# EasyEDA Pro project PCB.epro

# Board PCB1
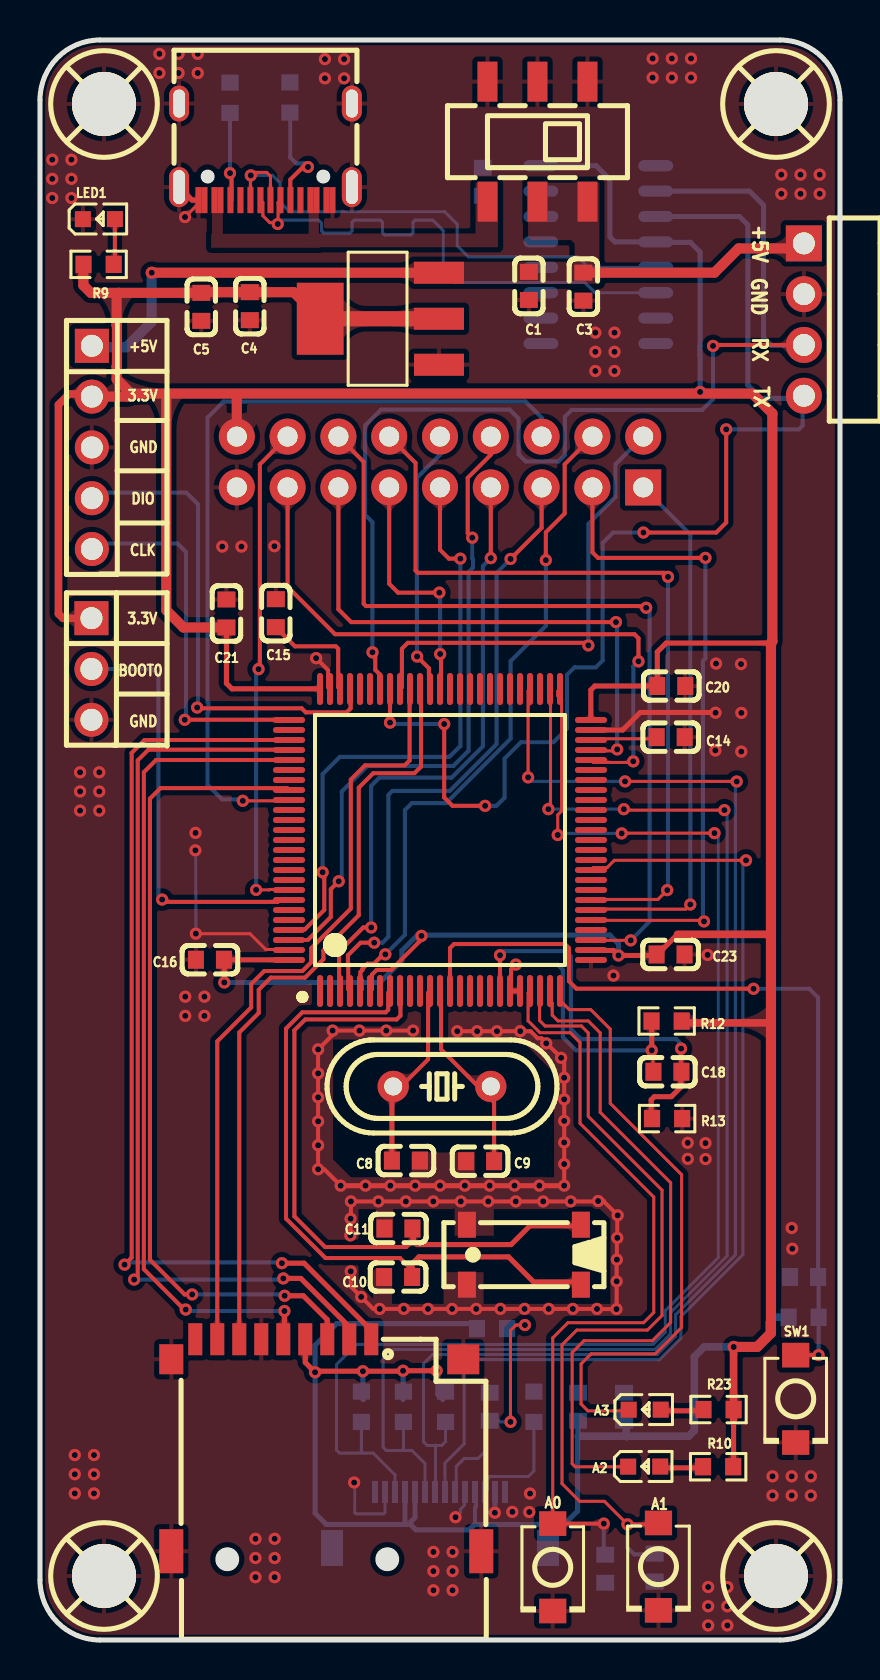
[diagram p0: board, top side]
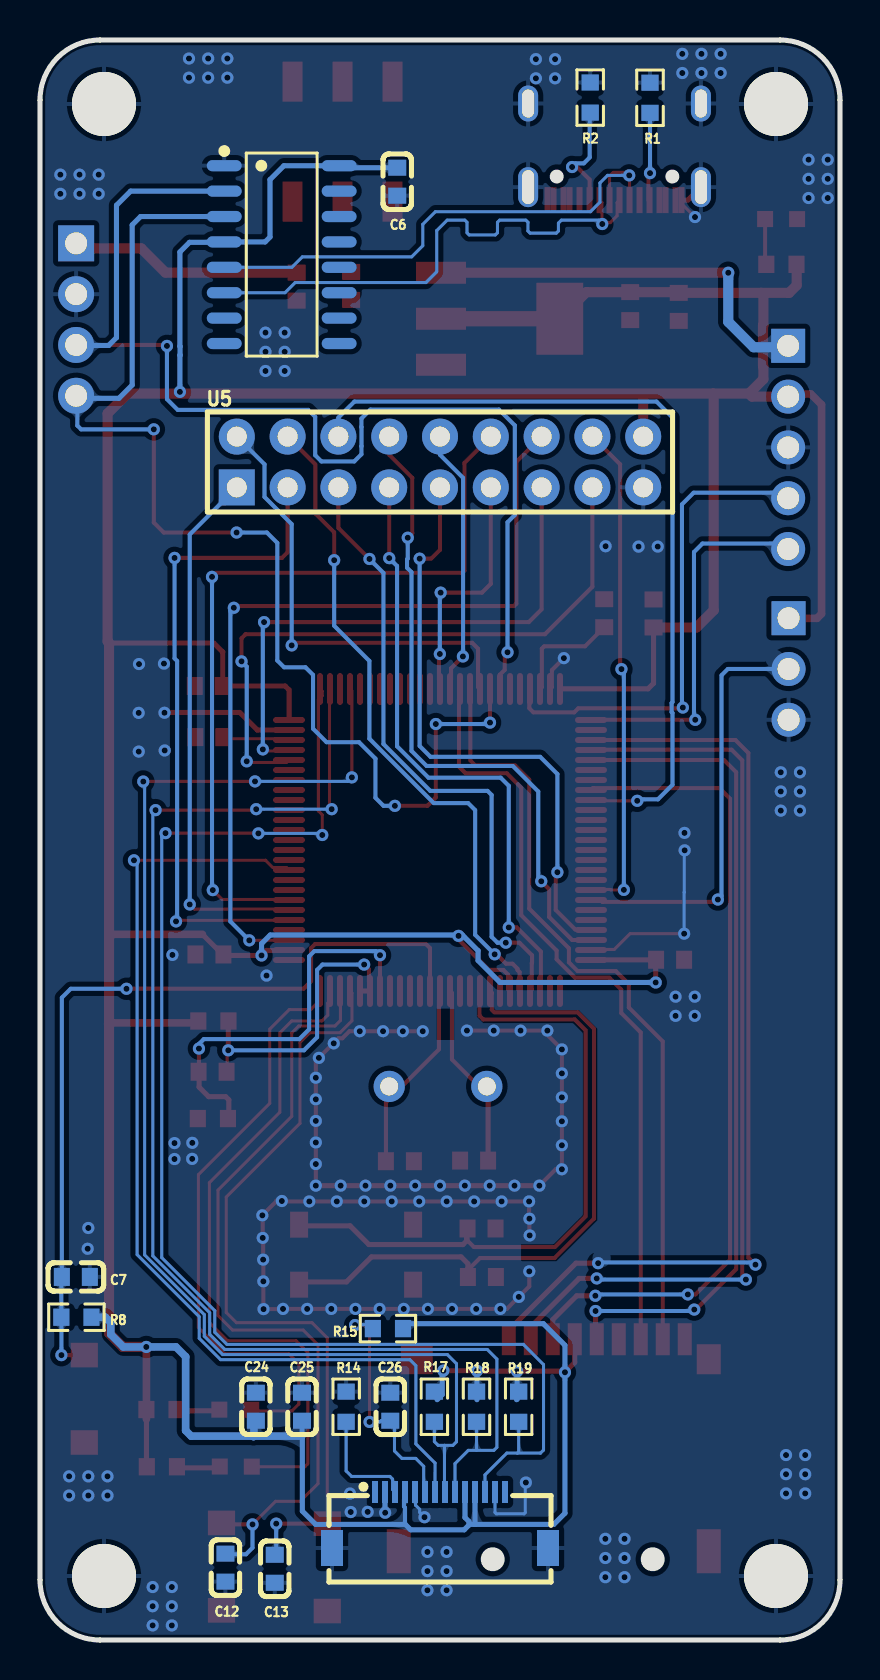
[diagram p1: board, bottom side, seen from below]

Outline 40 x 80 mm; copper layers: Top Layer, Bottom Layer. Coordinates in mm from the lower left corner of the outline.
Outline path: 0,77 0,3 arc(0.88,0.88) 3,0 37,0 arc(39.12,0.88) 40,3 40,77 arc(39.12,79.12) 37,80 3,80 arc(0.88,79.12) 0,77
Stack: Top Layer 0.035mm / Dielectric1 1.51mm FR4 er 4.5 / Bottom Layer 0.035mm

## Design rules (mm)
net OSCH1: DP2
net OSCH2: DP2
net OSCL1: DP1
net OSCL2: DP1
net DP: DP3
net DN: DP3
template: JLCPCB Capability(Two Layers Board)
spacing copperThickness1oz (default): track to track 0.102, other pairs 0.152 to 0.3
spacing copperThickness2oz: track to track 0.203, other pairs 0.152 to 0.3
track width copperThickness1oz (default): min 0.127, default 0.254, max 2.54
track width copperThickness2oz: min 0.203, default 0.254, max 2.54
differential pair differentialPair (default): width min 0.127, default 0.254, max 2.54; gap min 0.152, default 0.152
via viaSize (default): diameter min 0.5, default 0.61, max 10; hole min 0.3, default 0.305, max 6.3

## Placement (name value [footprint] x y rotation side)
A2  -  [LED_0603]  30.26 8.68 0 top
A3  -  [LED_0603]  30.29 11.52 0 top
C1  100nF  [C0603]  24.44 67.7 90 top
C3  10uF  [C0603]  27.17 67.67 90 top
C4  10uF  [C0603]  10.49 66.69 90 top
C5  100nF  [C0603]  8.06 66.66 90 top
C6  100nF  [C0603]  22.14 72.91 270 bottom
C7  100nF  [C0603]  38.21 18.15 0 bottom
C8  33pF  [C0603]  18.3 23.97 180 top
C9  33pF  [C0603]  22 23.94 180 top
C10  18pF  [C0603]  17.91 18.15 0 top
C11  18pF  [C0603]  17.92 20.57 0 top
C12  100nF  [C0603]  30.73 3.62 90 bottom
C13  100nF  [C0603]  28.26 3.56 90 bottom
C14  2.2uF  [C0603]  31.53 45.14 0 top
C15  2.2uF  [C0603]  11.79 51.34 270 top
C16  100nF  [C0603]  8.5 34.01 0 top
C18  10uF  [C0603]  31.37 28.41 0 top
C20  100nF  [C0603]  31.56 47.7 0 top
C21  100nF  [C0603]  9.32 51.33 90 top
C23  100nF  [C0603]  31.53 34.28 0 top
C24  10uF  [C0603]  29.21 11.66 270 bottom
C25  100nF  [C0603]  26.9 11.66 270 bottom
C26  100nF  [C0603]  22.49 11.66 90 bottom
CARD1  TF PUSH  [TF-SMD_TF-PUSH]  14.31 9.74 0 top
FPC1  FPC-05F-14PH15  [FPC-SMD_14P-P0.50_XUNPU_FPC-05F-14PH15]  20 6 180 bottom
H1  PZ254V-11-05P  [HDR-TH_5P-P2.54-V-M]  2.59 59.63 270 top
H2  PZ254V-11-03P  [HDR-TH_3P-P2.54-V-M]  2.57 48.55 270 top
H3  HX PZ2.54-1x4P WZ  [HDR-TH_4P-P2.54-H-M-W10.3]  38.19 66.02 270 top
LED1  -  [LED_0603]  3 71.05 0 top
R1  5.1K  [R0603]  9.5 77.11 90 bottom
R2  5.1K  [R0603]  12.49 77.12 90 bottom
R8  10K  [R0603]  38.18 16.14 0 bottom
R9  2K  [R0603]  2.93 68.78 0 top
R10  2K  [R0603]  33.91 8.66 180 top
R12  0  [R0603]  31.33 30.95 180 top
R13  0  [R0603]  31.35 26.07 180 top
R14  10  [R0603]  24.69 11.66 270 bottom
R15  10K  [R0603]  22.6 15.57 180 bottom
R17  10K  [R0603]  20.28 11.66 90 bottom
R18  10K  [R0603]  18.17 11.66 90 bottom
R19  10K  [R0603]  16.07 11.66 90 bottom
R23  2K  [R0603]  33.93 11.52 180 top
SCREW1  -  [M3螺丝]  36.8 76.8 0 top
SCREW2  -  [M3螺丝]  3.2 76.8 0 top
SCREW3  -  [M3螺丝]  36.8 3.2 0 top
SCREW4  -  [M3螺丝]  3.2 3.2 0 top
SW1  TS-1088R-02026  [SW-SMD_L3.9-W3.0-P4.45]  37.78 12.06 270 top
SW2  TS-1088R-02026  [SW-SMD_L3.9-W3.0-P4.45]  30.92 3.67 270 top
SW3  TS-1088R-02026  [SW-SMD_L3.9-W3.0-P4.45]  25.64 3.63 270 top
U1  STM32H743VIT6  [LQFP-100_L14.0-W14.0-P0.50-LS16.0-BL]  20 40 0 top
U3  AMS1117-3.3  [SOT-223-3_L6.5-W3.4-P2.30-LS7.0-BR]  16.98 66.06 0 top
U4  CH340C  [SOP-16_L10.0-W3.9-P1.27-LS6.0-BL]  27.91 69.27 270 bottom
U5  HC-PM254-8.5H-2x9PZ  [HDR-TH_18P-P2.54-V-F-R2-C9-S2.54-3]  20 58.9 180 bottom
U6  YSSP2AG00  [SW-SMD_YSSP2AG00]  24.87 74.92 180 top
USB1  HC-TYPE-C-16P-01B  [USB-C-SMD_KH-TYPE-C-16P]  11.27 74.41 180 top
X1  8MHz  [HC-49S_L11.5-W4.7-P4.88]  20.1 27.68 0 top
X2  32.768kHz  [MC-306_4P-L8.0-W3.2-P5.5-BL]  24.2 19.27 180 top

## Footprints (pads in the part's own frame, mm; a bottom-side part is the same pattern mirrored in y, then rotated)
C0603
  rect 0.8x0.9 smd: 1(-0.7,0) 2(0.7,0)
FPC-SMD_14P-P0.50_XUNPU_FPC-05F-14PH15
  rect 0.3x1.1 smd: 1(-3.25,1.4) 2(-2.75,1.4) 3(-2.25,1.4) 4(-1.75,1.4) 5(-1.25,1.4) 6(-0.75,1.4) 7(-0.25,1.4) 8(0.25,1.4) 9(0.75,1.4) 10(1.25,1.4) 11(1.75,1.4) 12(2.25,1.4) 13(2.75,1.4) 14(3.25,1.4)
  rect 1.1x1.8 smd: 15(5.4,-1.4) 16(-5.4,-1.4)
HC-49S_L11.5-W4.7-P4.88
  round 1.56 hole 0.9: 1(-2.44,0) 2(2.44,0)
HDR-TH_3P-P2.54-V-M
  rect 1.7x1.7 hole 1.1: 1(-2.54,0)
  round 1.7 hole 1.1: 2(0,0) 3(2.54,0)
HDR-TH_4P-P2.54-H-M-W10.3
  rect 1.8x1.8 hole 1.1: 1(-3.81,0)
  round 1.8 hole 1.1: 2(-1.27,0) 3(1.27,0) 4(3.81,0)
HDR-TH_5P-P2.54-V-M
  rect 1.7x1.7 hole 1.1: 1(-5.08,0)
  round 1.7 hole 1.1: 2(-2.54,0) 3(0,0) 4(2.54,0) 5(5.08,0)
HDR-TH_18P-P2.54-V-F-R2-C9-S2.54-3
  rect 1.8x1.8 hole 1: 1(-10.16,-1.27)
  round 1.8 hole 1: 2(-10.16,1.27) 3(-7.62,-1.27) 4(-7.62,1.27) 5(-5.08,-1.27) 6(-5.08,1.27) 7(-2.54,-1.27) 8(-2.54,1.27) 9(0,-1.27) 10(0,1.27) 11(2.54,-1.27) 12(2.54,1.27) 13(5.08,-1.27) 14(5.08,1.27) 15(7.62,-1.27) 16(7.62,1.27) 17(10.16,-1.27) 18(10.16,1.27)
LED_0603
  rect 0.8x0.8 smd: 1(-0.851,-0.01) 2(0.75,-0.005)
LQFP-100_L14.0-W14.0-P0.50-LS16.0-BL
  oval 0.3x1.6 smd: 1(-6,-7.55) 2(-5.5,-7.55) 3(-5,-7.55) 4(-4.5,-7.55) 5(-4,-7.55) 6(-3.5,-7.55) 7(-3,-7.55) 8(-2.5,-7.55) 9(-2,-7.55) 10(-1.5,-7.55) 11(-1,-7.55) 12(-0.5,-7.55) 13(0,-7.55) 14(0.5,-7.55) 15(1,-7.55) 16(1.5,-7.55) 17(2,-7.55) 18(2.5,-7.55) 19(3,-7.55) 20(3.5,-7.55) 21(4,-7.55) 22(4.5,-7.55) 23(5,-7.55) 24(5.5,-7.55) 25(6,-7.55) 51(6,7.55) 52(5.5,7.55) 53(5,7.55) 54(4.5,7.55) 55(4,7.55) 56(3.5,7.55) 57(3,7.55) 58(2.5,7.55) 59(2,7.55) 60(1.5,7.55) 61(1,7.55) 62(0.5,7.55) 63(0,7.55) 64(-0.5,7.55) 65(-1,7.55) 66(-1.5,7.55) 67(-2,7.55) 68(-2.5,7.55) 69(-3,7.55) 70(-3.5,7.55) 71(-4,7.55) 72(-4.5,7.55) 73(-5,7.55) 74(-5.5,7.55) 75(-6,7.55)
  oval 1.6x0.3 smd: 26(7.55,-6) 27(7.55,-5.5) 28(7.55,-5) 29(7.55,-4.5) 30(7.55,-4) 31(7.55,-3.5) 32(7.55,-3) 33(7.55,-2.5) 34(7.55,-2) 35(7.55,-1.5) 36(7.55,-1) 37(7.55,-0.5) 38(7.55,0) 39(7.55,0.5) 40(7.55,1) 41(7.55,1.5) 42(7.55,2) 43(7.55,2.5) 44(7.55,3) 45(7.55,3.5) 46(7.55,4) 47(7.55,4.5) 48(7.55,5) 49(7.55,5.5) 50(7.55,6) 76(-7.55,6) 77(-7.55,5.5) 78(-7.55,5) 79(-7.55,4.5) 80(-7.55,4) 81(-7.55,3.5) 82(-7.55,3) 83(-7.55,2.5) 84(-7.55,2) 85(-7.55,1.5) 86(-7.55,1) 87(-7.55,0.5) 88(-7.55,0) 89(-7.55,-0.5) 90(-7.55,-1) 91(-7.55,-1.5) 92(-7.55,-2) 93(-7.55,-2.5) 94(-7.55,-3) 95(-7.55,-3.5) 96(-7.55,-4) 97(-7.55,-4.5) 98(-7.55,-5) 99(-7.55,-5.5) 100(-7.55,-6)
M3螺丝
  round 3.2 hole 3.2: 1(0,0)
MC-306_4P-L8.0-W3.2-P5.5-BL
  rect 0.9x1.3 smd: 1(-2.85,-1.5) 2(2.85,-1.5) 3(2.85,1.5) 4(-2.85,1.5)
R0603
  rect 0.806x0.864 smd: 1(-0.753,0) 2(0.753,0)
SOP-16_L10.0-W3.9-P1.27-LS6.0-BL
  oval 0.56x1.745 smd: 1(-4.445,-2.873) 2(-3.175,-2.873) 3(-1.905,-2.873) 4(-0.635,-2.873) 5(0.635,-2.873) 6(1.905,-2.873) 7(3.175,-2.873) 8(4.445,-2.873) 9(4.445,2.873) 10(3.175,2.873) 11(1.905,2.873) 12(0.635,2.873) 13(-0.635,2.873) 14(-1.905,2.873) 15(-3.175,2.873) 16(-4.445,2.873)
SOT-223-3_L6.5-W3.4-P2.30-LS7.0-BR
  rect 2.5x1.1 smd: 1(2.97,-2.3) 2(2.97,0) 3(2.97,2.3)
  rect 2.34x3.6 smd: 4(-2.97,0)
SW-SMD_L3.9-W3.0-P4.45
  rect 1.23x1.36 smd: 1(-2.185,0) 2(2.185,0)
SW-SMD_YSSP2AG00
  rect 1x2 smd: 1(-2.5,3) 2(0,3) 3(2.5,3) 4(-2.5,-3) 5(0,-3) 6(2.5,-3)
TF-SMD_TF-PUSH
  rect 0.7x1.6 smd: 1(2.25,5.3) 2(1.15,5.3) 3(0.05,5.3) 4(-1.05,5.3) 5(-2.15,5.3) 6(-3.25,5.3) 7(-4.35,5.3) 8(-5.45,5.3) CD(-6.55,5.3)
  rect 1.2x1.5 smd: 10(-7.75,4.3)
  rect 1.2x2.2 smd: 11(-7.75,-5.3) 12(7.75,-5.3)
  rect 1.6x1.5 smd: 13(6.85,4.3)
USB-C-SMD_KH-TYPE-C-16P
  oval 1x2 hole 0.6x1.7: 1(-4.32,1.765) 2(4.32,1.765)
  oval 1x1.8 hole 0.6x1.4: 3(-4.32,-2.415) 4(4.32,-2.415)
  rect 0.3x1.3 smd: A1(-3.35,2.415) A4(-2.55,2.415) A5(-1.25,2.415) A6(-0.25,2.415) A7(0.25,2.415) A8(1.25,2.415) A9(2.55,2.415) A12(3.35,2.415) B1(3.05,2.415) B4(2.25,2.415) B5(1.75,2.415) B6(0.75,2.415) B7(-0.75,2.415) B8(-1.75,2.415) B9(-2.25,2.415) B12(-3.05,2.415)

## Nets
AGND: C18.2 R13.2 U1.19
GND: C1.1 C3.1 C4.1 C5.1 C6.2 C7.1 C8.1 C9.2 C10.1 C11.1 C12.1 C13.1 C14.2 C15.1 C16.1 C20.2 C21.2 C23.2 C24.1 C25.1 C26.2 CARD1.6 CARD1.10 CARD1.11 CARD1.12 CARD1.13 FPC1.2 FPC1.5 FPC1.13 FPC1.15 FPC1.16 H1.3 H2.3 H3.2 LED1.1 R1.2 R2.2 R13.1 R14.1 SCREW1.1 SCREW2.1 SCREW3.1 SCREW4.1 SW1.2 SW2.2 SW3.2 U1.26 U1.49 U1.74 U1.99 U3.1 U4.1 U5.17 U6.4 U6.5 U6.6 USB1.1 USB1.2 USB1.3 USB1.4 USB1.A1 USB1.A12 USB1.B1 USB1.B12 X2.2 X2.3
VCC+3.3V: C4.2 C5.2 C6.1 C16.2 C20.1 C21.1 C23.1 C24.2 C25.2 CARD1.4 FPC1.4 FPC1.10 FPC1.11 H1.2 H2.1 R8.1 R9.1 R10.1 R12.1 R15.2 R17.2 R18.2 R19.2 R23.1 U1.6 U1.27 U1.50 U1.75 U1.100 U3.2 U3.4 U4.4 U4.16 U5.18
VCC+5V: C1.2 C3.2 H1.1 H3.1 U3.3 U6.1 U6.2
VCCA+3.3V: C18.1 R12.2 U1.20 U1.21
BOOT0: H2.2 U1.94
CAM_RST: U1.32 U5.12
CC1: R2.1 USB1.A5
CC2: R1.1 USB1.B5
CS: FPC1.12 R19.1 U1.51
CSI_D0: U1.63 U5.11
CSI_D1: U1.64 U5.10
CSI_D2: U1.97 U5.9
CSI_D3: U1.98 U5.8
CSI_D4: U1.3 U5.7
CSI_D5: U1.84 U5.6
CSI_D6: U1.4 U5.5
CSI_D7: U1.5 U5.4
CSI_HSYNC: U1.28 U5.14
CSI_MCLK: U1.67 U5.2
CSI_PCLK: U1.30 U5.3
CSI_PWDN: U1.31 U5.1
CSI_VSYNC: U1.93 U5.16
DC: FPC1.7 U1.35
DN: U4.6 USB1.A7 USB1.B7
DP: U4.5 USB1.A6 USB1.B6
NRST: C26.1 FPC1.6 R15.1
OSCH1: C8.2 U1.12 X1.1
OSCH2: C9.1 U1.13 X1.2
OSCL1: C10.2 U1.8 X2.4
OSCL2: C11.2 U1.9 X2.1
PA0: C13.2 SW3.1 U1.22
PA1: C12.2 SW2.1 U1.23
PA2: A2.1 U1.24
PA3: A3.1 U1.25
PA5: U1.29
PA9: H3.4 U1.68 U4.3
PA10: H3.3 U1.69 U4.2
PA11: U1.70
PA12: U1.71
PA13: H1.4 U1.72
PA14: H1.5 U1.76
PA15: U1.77
PB0: U1.34
PB2: U1.36
PB3: U1.89
PB4: U1.90
PB5: U1.91
PB6: U1.92
PB8: U1.95
PB9: U1.96
PB10: U1.46 U5.15
PB11: U1.47 U5.13
PB13: FPC1.9 R18.1 U1.52
PB14: U1.53
PB15: FPC1.8 R17.1 U1.54
PC0: U1.15
PC1: U1.16
PC2: U1.17
PC3: U1.18
PC5: U1.33
PC8: CARD1.7 U1.65
PC9: CARD1.8 U1.66
PC10: CARD1.1 U1.78
PC11: CARD1.2 U1.79
PC12: CARD1.5 U1.80
PC13: U1.7
PD0: U1.81
PD1: U1.82
PD2: CARD1.3 U1.83
PD4: U1.85
PD5: U1.86
PD6: U1.87
PD7: U1.88
PD8: U1.55
PD9: U1.56
PD10: U1.57
PD11: U1.58
PD12: U1.59
PD13: U1.60
PD14: U1.61
PD15: U1.62
PE2: U1.1
PE3: U1.2
PE7: U1.37
PE8: U1.38
PE9: U1.39
PE10: U1.40
PE11: U1.41
PE12: U1.42
PE13: U1.43
PE14: U1.44
PE15: U1.45
RST: C7.2 R8.2 SW1.1 U1.14
USB+5V: U6.3 USB1.A4 USB1.A9 USB1.B4 USB1.B9
$1N4402: LED1.2 R9.2
$1N4428: A2.2 R10.2
$1N4531: C14.1 U1.48
$1N4556: C15.2 U1.73
$1N9245: FPC1.3 R14.2
$1N24827: A3.2 R23.2

Pads without a net: CARD1 CD; FPC1 1 14; U1 10 11; U4 7 8 9 10 11 12 13 14 15; USB1 A8 B8

## Via types
v1: diameter 0.61, hole 0.305, Top Layer to Bottom Layer, 242 vias

## Routing (per net, layer and track width the routed paths; a pad name or vN(x,y) marks a point on that pad's centre or on a via; arc(x,y) is an arc through that point)
AGND: length 19.7
  Top Layer w0.203: U1.19 v1(23,34.24) ; v1(32.05,29.57) 32.05,28.41 32.04,28.4
  Top Layer w0.254: 30.59,26.18 30.56,26.21 30.56,27.01 30.72,27.17 31.57,27.17 32.04,27.64 32.04,28.4
  Bottom Layer w0.203: v1(32.05,29.57) 32.05,29.8 31.81,30.04 27.04,30.04 26.54,30.54 26.54,34.18 26.28,34.44 23.2,34.44 v1(23,34.24)
GND: length 97.2
  Top Layer w0.152: U1.99 11.99,34.5 11.96,34.53 11.29,34.53 10.5,35.32 v1(7.79,35.32) ; v1(7.25,71.15) 7.92,71.82 USB1.A12
  Top Layer w0.203: v1(26.21,22.72) v1(26.21,23.8) v1(26.21,24.88) v1(26.21,25.95) v1(26.21,27.03) v1(26.21,28.11) 26.21,28.95 v1(26.06,29.11) 25.08,30.09 24.88,30.09 24.53,30.44 v1(24.01,30.44) v1(22.85,30.44) v1(21.86,30.44) v1(20.86,30.44) ; v1(15.52,20.23) 15.53,20.24 v1(15.53,21.07) 15.55,21.08 v1(15.55,21.93) v1(16.92,21.93) v1(18.29,21.93) v1(19.67,21.93) v1(21.04,21.93) v1(22.41,21.93) v1(23.79,21.93) v1(25.16,21.93) v1(26.53,21.93) 27.89,21.93 ; v1(15.54,18.43) 15.54,17.68 v1(16.06,17.15) 16.66,16.55 v1(16.98,16.55) v1(18.19,16.55) v1(19.4,16.55) v1(20.61,16.55) v1(21.81,16.55) v1(23.02,16.55) v1(24.23,16.55) v1(25.43,16.55) v1(26.64,16.55) v1(27.85,16.55) 27.86,16.54 v1(28.82,16.54) 28.83,16.55 v1(28.83,17.93) 28.83,19.01 v1(28.84,19.02) 28.84,20.09 v1(28.86,20.11) 28.86,21.21 v1(28.88,21.23) 28.17,21.95 ; v1(15.03,22.72) 14.21,23.54 v1(13.91,23.54) v1(13.91,24.74) v1(13.91,25.93) v1(13.91,27.13) v1(13.91,28.33) v1(13.91,29.53) 14.63,30.26 v1(14.63,30.47) v1(15.97,30.47) v1(17.31,30.47) v1(18.65,30.47) ; U1.74 14.41,47.64 14.41,48.49 v1(13.81,49.09)
  Top Layer w0.254: 27.89,21.93 v1(27.91,21.95) 28.17,21.95 ; USB1.2 7.6,71.99 USB1.A12 ; v1(15.03,22.72) v1(16.27,22.72) v1(17.52,22.72) v1(18.76,22.72) v1(20,22.72) v1(21.24,22.72) v1(22.48,22.72) v1(23.73,22.72) v1(24.97,22.72) v1(26.21,22.72) ; U1.49 29.14,45.5 30.01,46.38 33.76,46.38 v1(33.78,46.36)
  Bottom Layer w0.152: FPC1.5 21.25,7.03 21.22,7.01 21.22,6.74 21.02,6.53 21.02,6.38 v1(20.78,6.14) ; FPC1.13 17.25,6.37 17.19,6.31 15.8,6.31 15.74,6.37 15.74,7.84 v1(15.71,7.87) ; v1(7.79,35.32) 7.79,37.38 7.79,37.39 7.79,39.47 v1(7.77,39.48)
  Bottom Layer w0.254: FPC1.2 22.75,6.37 v1(22.74,6.36)
  vias: v1(0.61,74.02) v1(0.61,73.06) v1(0.61,72.1) v1(1.57,74.02) v1(1.57,73.06) v1(1.57,72.1) v1(1.74,9.25) v1(1.74,8.29) v1(1.74,7.33) v1(2,43.39) v1(2,42.43) v1(2,41.47) v1(2.7,9.25) v1(2.7,8.29) v1(2.7,7.33) v1(2.96,43.39) v1(2.96,42.43) v1(2.96,41.47) v1(5.97,79.31) v1(5.97,78.35) v1(6.93,79.31) v1(6.93,78.35) v1(7.26,32.17) v1(7.26,31.21) v1(7.78,40.36) v1(7.89,79.31) v1(7.89,78.35) v1(8.22,32.17) v1(8.22,31.21) v1(9.11,54.67) v1(10.07,54.67) v1(10.77,5.06) v1(10.77,4.1) v1(10.77,3.14) v1(11.72,54.69) v1(11.73,5.06) v1(11.73,4.1) v1(11.73,3.14) v1(14.25,79.04) v1(14.25,78.08) v1(15.21,79.04) v1(15.21,78.08) v1(19.67,4.4) v1(19.67,3.44) v1(19.67,2.49) v1(20.63,4.4) v1(20.63,3.44) v1(20.63,2.49) v1(23.62,6.41) v1(24.5,7.32) v1(24.46,6.4) v1(25.31,29.83) v1(27.77,65.37) v1(27.77,64.41) v1(27.77,63.45) v1(28.73,65.37) v1(28.73,64.41) v1(28.73,63.45) v1(28.67,33.22) v1(30.63,79.07) v1(30.63,78.12) v1(31.59,79.07) v1(31.59,78.12) v1(32.39,24.86) v1(32.39,24.06) v1(32.55,79.07) v1(32.55,78.12) v1(33.28,24.85) v1(33.28,24.05) v1(33.38,34.25) v1(33.41,2.65) v1(33.41,1.69) v1(33.41,0.73) v1(33.8,48.82) v1(33.77,44.48) v1(34.37,2.65) v1(34.37,1.69) v1(34.37,0.73) v1(35.05,48.8) v1(35.07,46.36) v1(35.06,44.42) v1(36.63,8.18) v1(36.63,7.22) v1(37.07,73.27) v1(37.07,72.31) v1(37.59,20.6) v1(37.62,19.56) v1(37.59,8.18) v1(37.59,7.22) v1(38.02,73.27) v1(38.02,72.31) v1(38.54,8.18) v1(38.54,7.22) v1(38.98,73.27) v1(38.98,72.31)
VCC+3.3V: length 298.7
  Top Layer w0.203: U1.6 16.6,32.55 16.6,33.27 16.83,33.5 17.55,33.5 19.07,35.02 v1(19.07,35.21)
  Top Layer w0.254: U1.75 13.99,47.56 9.6,47.56 9.32,47.83 C21.1 ; 13.26,15.04 13.26,13.88 v1(13.75,13.39) 13.81,13.44 v1(16.15,13.44) 18.13,13.44 v1(18.15,13.46) 19.83,13.46 v1(19.83,13.47) ; U1.50 27.54,46.01 27.54,47.5 27.74,47.7 C20.1 30.86,49.4 31.31,49.85 36.43,49.85 ; U1.27 28.12,34.5 28.14,34.48 28.67,34.48 v1(28.92,34.23) 30.82,34.23 31.88,35.28 ; 34.68,11.04 34.68,8.68 R10.1 ; v1(9.22,32.88) 9.22,34.01 12.44,34.01 U1.100
  Top Layer w0.381: 34.68,11.04 R23.1 34.68,14.5 ; 2.63,51.09 2.63,51.08 1.15,51.08 0.92,51.31 0.92,61.77 1.46,62.3 2.33,62.3 2.48,62.44 ; R12.1 32.18,30.86 36.49,30.86 36.55,30.8 ; 31.88,35.28 36.47,35.28 ; 36.55,35.16 36.48,35.09 36.55,35.09 36.55,35.16
  Top Layer w0.508: 4.55,62.32 4.4,62.17 2.59,62.17 ; 4.55,62.32 3.83,63.04 3.83,63.67 3.85,63.69 3.85,65.73 3.83,65.74 3.83,67.24 3.95,67.36 ; 4.55,62.32 6.34,62.32 ; 36.55,49.85 36.55,35.16 ; 6.34,62.32 6.31,62.3 6.31,51.49 7.18,50.63 C21.1 ; 6.34,62.32 35.62,62.32 36.62,61.33 36.62,49.93 36.56,49.87 ; v1(34.69,14.65) 35.86,14.65 36.55,15.34 36.55,35.09 ; R9.1 2.17,68.77 2.17,67.73 2.55,67.36 3.95,67.36 ; U5.18 9.84,62.13 ; 3.95,67.36 C5.2 8.1,67.39 C4.2 12.68,67.39 U3.4
  Top Layer w0.762: U3.2 U3.4
  Bottom Layer w0.203: 21.75,5.79 21.75,6.62 21.8,6.67 21.8,7.02 21.75,7.07 FPC1.4
  Bottom Layer w0.254: C6.1 24.94,73.61 U4.16 27.8,73.71 28.5,73.02 28.5,70.15 28.74,69.9 U4.4 30.81,69.88 32.52,69.88 33,69.4 33,64.69 33,64.68 33,64.24 33,64.23 v1(33,62.41) ; 20.14,12.02 19.89,12.27 19.89,13.41 v1(19.83,13.47) ; 18.25,5.78 18.52,5.78 18.55,5.75 ; 18.25,5.78 FPC1.11 ; 18.25,5.78 14.31,5.78 13.75,6.34 v1(13.75,13.39) 13.75,14.74 14.83,15.82 21.84,15.82 21.84,15.78 21.85,15.77 ; 26.9,10.18 26.88,10.16 26.88,6.44 26.22,5.78 21.74,5.78 21.47,5.51 18.79,5.51 18.55,5.75 ; 26.9,10.18 26.91,10.19 ; 26.9,10.18 C25.2 ; v1(16.15,13.44) 16.15,12.04 16.17,12.02 ; 18.55,5.75 18.55,5.92 18.75,6.12 FPC1.10 ; v1(28.92,34.23) 28.92,34.81 28.49,35.25 18.88,35.25 18.09,34.47 18.09,33.97 17,32.88 v1(9.22,32.88) ; v1(18.15,13.46) 18.15,12.02
  Bottom Layer w0.381: 26.91,10.19 29.3,10.19 ; 29.3,10.19 29.3,10.86 C24.2 ; 29.3,10.19 29.33,10.17 29.35,10.19 32.44,10.19 32.72,10.47 32.72,14.17 33.2,14.65 v1(34.69,14.65) 35.83,14.65 36.46,15.28 36.46,15.87 36.73,16.14 R8.1
VCC+5V: length 32
  Top Layer w0.508: C3.2 33.73,68.37 34.94,69.58 37.94,69.58 H3.1 ; U3.3 v1(5.59,68.36)
  Bottom Layer w0.508: v1(5.59,68.36) 5.59,65.91 4.32,64.64 2.66,64.64 H1.1
VCCA+3.3V: length 14.7
  Top Layer w0.152: v1(30.59,29.48) 30.65,29.43 30.65,28.4
  Top Layer w0.203: U1.20 23.5,32.88 23.55,32.93 23.55,33.53 v1(23.79,33.77)
  Top Layer w0.254: 30.59,30.63 30.59,30.62 v1(30.59,29.48) ; U1.21 U1.20
  Bottom Layer w0.203: v1(23.79,33.77) 25.88,33.77 26.15,33.5 26.15,30.14 26.8,29.48 v1(30.59,29.48)
BOOT0: length 21.2
  Top Layer w0.203: U1.94 12.43,37.02 12,37.02 11.88,36.91 6.22,36.91 v1(6.11,37.02)
  Bottom Layer w0.203: 2.63,48.55 5.61,48.55 5.92,48.23 5.92,37.21 v1(6.11,37.02)
CAM_RST: length 39.7
  Top Layer w0.152: v1(31.36,37.49) 30.89,37.03 27.58,37.03 U1.32
  Top Layer w0.203: U5.12 18.78,58.85 18.78,53.47 18.89,53.36 31.2,53.36 v1(31.4,53.16)
  Bottom Layer w0.203: v1(31.36,37.49) 31.4,37.53 v1(31.4,53.16)
CC1: length 5.7
  Top Layer w0.203: USB1.A5 12.52,72 12.52,73.02 13.15,73.65 v1(13.4,73.65)
  Bottom Layer w0.203: 12.51,76.59 12.51,74.13 12.81,73.83 13.21,73.83 v1(13.4,73.65)
CC2: length 4.4
  Top Layer w0.203: 9.58,71.99 9.58,73.26 v1(9.5,73.34)
  Bottom Layer w0.203: R1.1 v1(9.5,73.34)
CS: length 68.8
  Top Layer w0.152: v1(25.89,40.25) 25.89,41.26 26.08,41.45 26.08,47.03 25.89,47.22 25.89,47.44 U1.51 ; v1(33.72,40.34) 29.09,40.34 v1(29.08,40.33)
  Bottom Layer w0.152: 16.13,9.34 16.07,9.41 R19.1 ; 16.13,9.34 14.98,9.34 14.82,9.5 14.82,13.77 15.83,14.78 30.65,14.78 31.26,15.39 31.26,16.47 33.91,19.12 33.91,40.16 v1(33.72,40.34) ; 16.13,9.34 16.66,9.34 17.75,8.26 FPC1.12 ; v1(25.89,40.25) 25.97,40.33 v1(29.08,40.33)
CSI_D0: length 12.4
  Top Layer w0.203: v1(19.97,52.37) 17.9,52.37 17.46,52.81 U5.11 ; v1(20.01,49.3) 20.05,49.26 20.05,48.03 20.01,47.99 20.01,47.56 U1.63
  Bottom Layer w0.203: v1(20.01,49.3) 20.01,52.33 v1(19.97,52.37)
CSI_D1: length 13.4
  Top Layer w0.203: v1(18.85,49.18) 19.45,48.58 19.45,48.03 19.5,47.98 U1.64
  Bottom Layer w0.203: v1(18.85,49.18) 18.85,49.19 18.85,58.11 20,59.26 U5.10
CSI_D2: length 30.2
  Top Layer w0.203: v1(14.13,38.39) 14.21,38.31 14.21,36.5 13.24,35.53 12.94,35.53 12.92,35.5 U1.97 ; v1(21.02,54.07) 20.44,54.07 20,54.51 U5.9
  Bottom Layer w0.203: v1(14.13,38.39) 14.13,38.39 14.13,43.3 14.99,44.16 20.47,44.16 21.02,44.7 v1(21.02,54.07)
CSI_D3: length 32.6
  Top Layer w0.203: U5.8 22.54,59.26 21.39,58.11 21.39,55.34 v1(21.61,55.11) ; U1.98 13.39,35 14.54,36.15 14.54,37.54 v1(14.94,37.94)
  Bottom Layer w0.203: v1(14.94,37.94) 15.09,38.09 15.09,42.42 16.36,43.7 20.67,43.7 21.43,44.46 21.43,53.39 21.65,53.61 21.65,54.03 21.61,54.07 v1(21.61,55.11)
CSI_D4: length 30.7
  Top Layer w0.203: U1.3 14.96,32.49 14.96,34.42 16.16,35.63 v1(16.56,35.63) ; U5.7 v1(22.54,54.09)
  Bottom Layer w0.203: v1(22.54,54.09) 22.15,53.7 22.15,44.69 20.58,43.12 16.97,43.12 16.56,42.71 v1(16.56,35.63)
CSI_D5: length 41.1
  Top Layer w0.152: v1(10.14,41.96) 12.41,41.96 U1.84
  Bottom Layer w0.203: U5.6 25.08,61.12 24.28,61.92 9.18,61.92 8.38,61.12 8.38,46.9 8.42,46.85 8.42,46.39 8.38,46.35 8.38,42.76 9.1,42.03 10.07,42.03 v1(10.14,41.96)
CSI_D6: length 31.6
  Top Layer w0.203: U1.4 15.41,32.54 15.41,33.85 15.4,33.86 15.4,34.23 16.03,34.86 v1(16.71,34.86) ; U5.5 25.08,55.6 v1(23.53,54.05)
  Bottom Layer w0.203: v1(23.53,54.05) 22.83,53.35 22.83,44.8 20.49,42.46 17.62,42.46 17.42,42.25 17.42,35.16 17.12,34.86 v1(16.71,34.86)
CSI_D7: length 33.8
  Top Layer w0.203: U5.4 26.23,58.78 26.23,56.33 25.29,55.39 v1(25.29,53.99) ; v1(17.27,34.28) 17.17,34.28 16.7,33.81 16.37,33.81 16.12,33.56 16.12,33.5 16.02,33.39 16.02,33.06 16.08,33 16.08,32.53 U1.5
  Bottom Layer w0.203: v1(17.27,34.28) 18.24,35.26 18.24,41.49 18.59,41.85 20.31,41.85 23.53,45.07 23.53,48.95 25.29,50.71 v1(25.29,53.99)
CSI_HSYNC: length 42.2
  Top Layer w0.152: v1(29.54,34.98) 27.57,34.98
  Top Layer w0.203: U5.14 16.18,58.91 16.18,51.81 16.3,51.7 30.22,51.7 v1(30.31,51.61) ; 27.56,34.99 U1.28
  Bottom Layer w0.203: v1(29.54,34.98) 30.48,35.93 30.48,51.44 v1(30.31,51.61)
CSI_MCLK: length 23.1
  Top Layer w0.203: v1(27.42,49.73) 27.29,49.86 18.39,49.86 18.1,49.57 18.1,47.65 U1.67
  Bottom Layer w0.203: v1(27.42,49.73) 27.42,55.79 28.77,57.15 28.77,58.78 U5.2
CSI_PCLK: length 33
  Top Layer w0.152: v1(33.2,35.93) 33.15,35.98 28.09,35.98 28.02,36.05 27.6,36.05 U1.30
  Top Layer w0.203: v1(33.27,54.11) 27.9,54.11 27.62,54.39 U5.3
  Bottom Layer w0.203: v1(33.27,54.11) 33.27,49.08 33.14,48.95 33.14,35.99 v1(33.2,35.93)
CSI_PWDN: length 26.9
  Top Layer w0.152: U1.31 27.6,36.55 30.44,36.55 30.44,36.54 32.28,36.54 v1(32.51,36.78)
  Bottom Layer w0.203: U5.1 32.51,55.28 v1(32.51,36.78)
CSI_VSYNC: length 25
  Top Layer w0.152: v1(10.81,37.51) 11.46,37.51 11.48,37.53 11.96,37.53 11.98,37.51 12.44,37.51 U1.93
  Top Layer w0.203: v1(10.93,48.54) 10.99,48.61 10.99,58.78 U5.16
  Bottom Layer w0.203: v1(10.81,37.51) 10.81,48.42 v1(10.93,48.54)
DC: length 51.3
  Top Layer w0.152: v1(35.3,38.98) 28.72,38.98 28.36,38.62 27.67,38.62 U1.35
  Bottom Layer w0.152: FPC1.7 20.25,8.85 21.21,9.81 21.21,13.72 21.51,14.02 30.97,14.02 32.04,15.09 32.04,16.16 35.14,19.27 35.14,38.83 v1(35.3,38.98)
DN: length 26.9
  Top Layer w0.152: v1(11.89,70.8) 11.9,70.81 11.9,70.89 ; USB1.B7 11.9,71.87 11.9,70.89 ; USB1.A7 11.15,71.87 11.15,71.21 11.49,70.87 11.88,70.87 11.9,70.89
  Bottom Layer w0.152: v1(11.89,70.8) 12.08,70.99 13.93,70.99 14.08,70.84 14.08,70.45 14.19,70.34 15.49,70.34 15.6,70.45 15.6,70.89 15.71,70.99 17.02,70.99 17.13,70.89 17.13,70.36 17.23,70.25 18.54,70.25 18.65,70.36 18.65,70.89 18.76,70.99 19.64,70.99 20.16,70.47 20.16,68.41 20.7,67.87 27.24,67.87 27.75,67.36 U4.6
DP: length 26.9
  Top Layer w0.152: USB1.B6 10.52,73.2 10.71,73.38 11.34,73.38 11.52,73.19 USB1.A6
  Bottom Layer w0.152: U4.5 27.41,68.63 26.88,69.16 21.42,69.16 20.86,69.71 20.86,70.78 20.23,71.42 12.48,71.42 12,71.89 12,72.85 11.62,73.23 v1(10.54,73.23)
NRST: length 12.1
  Top Layer w0.152: v1(24.25,15.75) 23.79,15.75 23.52,15.48 v1(23.52,10.9)
  Bottom Layer w0.152: 23.36,15.77 24.22,15.77 v1(24.25,15.75) ; v1(23.52,10.9) 23,10.9 22.94,10.96 C26.1 22.28,10.75 22.28,9.45 21.9,9.08 21.21,9.08 20.82,8.68 20.82,7.47 FPC1.6
OSCH1: length 9.6
  Top Layer w0.203: U1.12 19.4,32.35 19.4,29.03 18.25,27.88 17.74,27.88
  Top Layer w0.254: 17.74,27.88 17.6,27.74 C8.2
OSCH2: length 9.6
  Top Layer w0.203: C9.1 22.7,26.88 20.05,29.53 20.05,31.97 20,32.02 U1.13
OSCL1: length 33.1
  Top Layer w0.203: U1.8 17.41,32.36 17.41,31.51 17.28,31.38 13.12,31.38 12.3,30.57 12.3,21.07 14.27,19.1 18,19.1 18.5,18.59 18.6,18.59 ; 18.6,18.25 C10.2
  Top Layer w0.254: 18.6,18.25 18.6,18.81 18.94,19.16 23.43,19.16 24.68,17.9 26.98,17.9 27.05,17.97
OSCL2: length 33.1
  Top Layer w0.203: U1.9 18.02,32.43 18.02,31.22 17.83,31.03 13.26,31.03 12.72,30.48 12.72,21.18 14.25,19.65 18.31,19.65 18.62,19.97 C11.2
  Top Layer w0.254: 18.67,20.62 18.62,20.68 ; 18.67,20.57 18.67,19.95 18.85,19.77 23.56,19.77 24.49,20.71 26.79,20.71 27.05,20.97
PA0: length 38.5
  Top Layer w0.152: SW3.1 25.64,15.1 26.4,15.87 30.18,15.87 30.69,16.38 30.69,22.15 27,25.83 27,29.87 26.51,30.37 25,30.37 24.4,30.96 24.4,32.35 U1.22
  Top Layer w0.203: SW3.1 v1(28.19,5.82)
  Bottom Layer w0.203: 28.25,4.34 28.19,4.4 v1(28.19,5.82)
PA1: length 40.7
  Top Layer w0.152: U1.23 24.98,32.43 24.98,30.98 25.25,30.7 27.07,30.7 27.41,30.36 27.41,26.18 31.1,22.49 31.1,16.22 30.37,15.5 26.84,15.5 26.1,14.76 26.1,7.82 26.99,6.93 28.22,6.93 v1(29.37,5.78)
  Top Layer w0.203: 30.92,5.78 v1(29.37,5.78)
  Bottom Layer w0.203: C12.2 30.69,4.28 29.7,4.28 29.37,4.61 v1(29.37,5.78)
PA2: length 34.1
  Top Layer w0.152: 29.46,8.44 29.24,8.66 26.76,8.66 26.61,8.81 26.61,14.37 27.2,14.97 30.62,14.97 31.53,15.87 31.53,22.86 28.01,26.39 28.01,30.36 27.41,30.95 25.9,30.95 25.61,31.24 25.61,31.85 25.5,31.96 U1.24
PA3: length 30.3
  Top Layer w0.152: U1.25 26,31.98 26.46,31.52 27.54,31.52 28.51,30.54 28.51,26.83 32.08,23.26 32.08,15.62 30.77,14.31 27.56,14.31 27.05,13.81 27.05,11.8 27.4,11.46 29.43,11.46
PA9: length 60.3
  Top Layer w0.203: U1.68 v1(17.5,45.87) ; v1(20.21,45.8) 20.21,42.13 20.63,41.71 v1(22.26,41.71) ; v1(34.31,60.53) 34.31,55.87 33.81,55.37 v1(30.17,55.37)
  Bottom Layer w0.203: v1(34.31,60.53) 37.94,60.53 38.13,60.72 38.13,62.15 ; v1(30.17,55.37) 28.66,55.37 28.14,54.85 28.14,48.98 27.79,48.64 26.73,48.64 26.35,48.26 26.35,45.57 25.67,44.89 24.05,44.89 23.23,44.07 23.23,42.11 22.82,41.71 v1(22.26,41.71) ; v1(17.5,45.87) 17.57,45.8 v1(20.21,45.8)
  Bottom Layer w0.254: H3.4 38.06,62.08 36.06,62.08 35.39,62.75 35.39,70.75 34.97,71.17 U4.3
PA10: length 57.5
  Top Layer w0.203: v1(33.65,64.7) 33.7,64.75 H3.3 ; U1.69 17,48.27 16.76,48.51 16.76,49.25 v1(16.62,49.39)
  Bottom Layer w0.203: v1(33.65,64.7) 33.65,62.05 33.11,61.51 26.59,61.51 26.24,61.16 26.24,59.24 25.93,58.93 24.29,58.93 23.93,59.29 23.93,59.69 23.93,59.69 23.93,60.65 23.93,60.65 23.93,61.07 23.48,61.52 17.05,61.52 16.26,60.73 16.26,56.25 16.62,55.89 v1(16.62,49.39)
  Bottom Layer w0.254: H3.3 38.17,64.73 36.57,64.73 36.18,65.12 36.18,71.73 35.47,72.44 U4.2
PA13: length 24.7
  Top Layer w0.203: U1.72 15.53,47.52 15.53,46.59 15.33,46.38 13.29,46.38 13.08,46.59 7.9,46.59 v1(7.86,46.62)
  Bottom Layer w0.203: v1(7.86,46.62) 7.9,46.67 7.9,56.78 7.32,57.36 2.48,57.36
PA14: length 18.6
  Top Layer w0.203: U1.76 12.44,46.01 v1(7.24,46.01)
  Bottom Layer w0.203: v1(7.24,46.01) 7.3,46.07 7.3,54.4 6.88,54.82 2.48,54.82
PB10: length 32
  Top Layer w0.152: U1.46 27.67,43.88 29.61,43.88 v1(29.66,43.93)
  Top Layer w0.203: U5.15 12.38,52.66 14.75,50.29 29.72,50.29 29.92,50.09 v1(29.92,48.93)
  Bottom Layer w0.203: v1(29.66,43.93) 29.66,48.67 v1(29.92,48.93)
PB11: length 28
  Top Layer w0.152: v1(28.86,44.53) 28.67,44.53 28.59,44.46 27.59,44.46 U1.47
  Top Layer w0.203: U5.13 14.92,51.53 15.56,50.89 v1(28.8,50.89)
  Bottom Layer w0.203: v1(28.86,44.53) 28.86,50.83 v1(28.8,50.89)
PB13: length 66.9
  Top Layer w0.152: v1(25.42,41.54) 25.53,41.65 25.53,47.52 U1.52 ; v1(34.22,41.49) 29.24,41.49 v1(29.19,41.54)
  Bottom Layer w0.152: FPC1.9 19.25,8.82 18.59,9.48 18.17,9.48 ; 18.17,9.48 17.31,9.48 17.16,9.63 17.16,14.04 17.64,14.53 30.76,14.53 31.52,15.28 31.52,16.36 34.36,19.2 34.36,41.36 v1(34.22,41.49) ; 18.17,9.48 R18.1 ; v1(29.19,41.54) v1(25.42,41.54)
PB15: length 65.6
  Top Layer w0.152: v1(29.25,42.93) 34.83,42.93 v1(34.84,42.92) ; U1.54 24.41,47.46 v1(24.41,43.13)
  Bottom Layer w0.152: R17.1 20.28,9.92 20.09,9.73 19.78,9.73 ; v1(24.41,43.13) 24.61,42.93 v1(29.25,42.93) ; 19.78,9.73 19.35,9.73 19.18,9.91 19.18,13.81 19.63,14.27 30.87,14.27 31.78,15.19 31.78,16.27 34.77,19.25 34.77,42.86 v1(34.84,42.92) ; 19.78,9.73 19.78,7.79 19.75,7.77 FPC1.8
PC8: length 38.5
  Top Layer w0.203: CARD1.7 9.96,30.38 10.94,31.35 10.94,32.52 11.54,33.12 13.25,33.12 14.17,34.03 14.17,34.47 15.94,36.24 15.94,42.62 16.66,43.34 18.72,43.34 19.05,43.67 19.05,47.05 19,47.1 U1.65
PC9: length 38.8
  Top Layer w0.203: U1.66 18.48,47.53 18.48,43.98 18.23,43.73 16.25,43.73 15.54,43.02 15.54,36.57 13.56,34.59 13.56,33.88 13.12,33.45 11.21,33.45 10.56,32.8 10.56,31.62 8.86,29.93 CARD1.8
PC10: length 48.1
  Top Layer w0.203: U1.78 5.23,45 4.58,44.35 4.58,19.12 v1(4.23,18.77)
  Top Layer w0.254: v1(12.09,18.84) 13.2,18.84 16.56,15.48 CARD1.1
  Bottom Layer w0.203: v1(4.23,18.77) 4.34,18.88 12.06,18.88 v1(12.09,18.84)
PC11: length 46.2
  Top Layer w0.203: U1.79 12.43,44.52 5.42,44.52 4.89,43.98 4.89,18.2 v1(4.71,18.02)
  Top Layer w0.254: v1(12.16,18.08) 13.04,18.08 15.46,15.66 CARD1.2
  Bottom Layer w0.203: v1(12.16,18.08) 12.11,18.02 v1(4.71,18.02)
PC12: length 41.7
  Top Layer w0.203: U1.80 5.8,44 5.19,43.39 5.19,18.54 7.21,16.52 v1(7.29,16.52)
  Top Layer w0.254: v1(12.22,16.45) 12.22,15.1 12.16,15.04
  Bottom Layer w0.203: v1(12.22,16.45) 7.36,16.45 v1(7.29,16.52)
PD2: length 41.3
  Top Layer w0.203: v1(7.61,17.28) 7.23,17.28 5.5,19.01 5.5,42.07 6.03,42.6 12.35,42.6 U1.83
  Top Layer w0.254: v1(12.23,17.21) 13.16,17.21 14.36,16.01 CARD1.3
  Bottom Layer w0.203: v1(12.23,17.21) 12.17,17.28 v1(7.61,17.28)
RST: length 41.7
  Top Layer w0.203: U1.14 20.5,34.6 20.7,34.8 26.25,34.8 26.45,34.6 26.45,32.94 26.82,32.56 35.67,32.56 v1(35.68,32.56) ; SW1.1 v1(38.93,14.24)
  Bottom Layer w0.203: v1(35.68,32.56) 38.46,32.56 38.91,32.12 C7.2 38.93,18.13 R8.2 38.93,16.13 v1(38.93,14.24)
$1N4402: length 2.3
  Top Layer w0.203: R9.2 3.75,68.84 LED1.2
$1N4428: length 2.3
  Top Layer w0.254: 31.06,8.45 31.06,8.44 31.23,8.61 33.09,8.61 33.22,8.47
$1N4531: length 3.3
  Top Layer w0.152: U1.48 28.01,45 28.08,45.06 30.75,45.06 C14.1
$1N4556: length 5.6
  Top Layer w0.203: C15.2 12.75,49.68 14.79,49.68 14.91,49.57 14.91,47.64 U1.73
$1N9245: length 5.6
  Bottom Layer w0.152: FPC1.3 22.37,7.52 22.37,8.04 22.51,8.18 24.42,8.18 24.69,8.45 R14.2
$1N24827: length 2.2
  Top Layer w0.254: 31.03,11.46 33.11,11.46 33.17,11.4

## Copper pours and planes (outline as drawn; the poured copper is in the pictures)
GND on Top Layer: 16.8,22.18 17.66,22.18 17.66,20.13 16.8,20.13
GND on Top Layer: 20.73,22.13 22.69,22.13 22.69,20.21 20.73,20.21
GND on Top Layer: 18.59,24.41 19.48,24.41 19.48,22.58 18.59,22.58
GND on Top Layer: 16.66,18.59 17.64,18.59 17.64,16.55 16.66,16.55
GND on Top Layer: 18.58,24.37 21.74,24.37 21.74,22.73 18.58,22.73
GND on Top Layer: 20.88,24.42 21.76,24.42 21.76,22.58 20.88,22.58
GND on Top Layer: -8.85,85.21 51.42,85.21 51.42,-6.58 -8.85,-6.58
GND on Top Layer: 20.18,18.39 22.18,18.39 22.18,16.23 20.18,16.23
GND on Bottom Layer: -8.13,88.7 50.23,88.7 50.23,-6.37 -8.13,-6.37
VCC+5V on Top Layer: 18.68,68.91 27.99,68.91 27.99,67.81 18.68,67.81
VCC+5V on Top Layer: 24.4,72.87 27.97,72.87 27.97,67.95 24.4,67.95
USB+5V on Top Layer: 8.56,70.31 13.98,70.31 13.98,69.61 8.56,69.61
USB+5V on Top Layer: 13.39,72.84 22.9,72.84 22.9,69.64 13.39,69.64
USB+5V on Top Layer: 8.6,72.15 9.14,72.15 9.14,70.03 8.6,70.03
USB+5V on Top Layer: 13.44,72.1 13.94,72.1 13.94,69.98 13.44,69.98

Small or netless copper shapes (teardrops, artwork), in the pictures only: 303 on Top Layer, 142 on Bottom Layer

## Text on the board
Top Silkscreen Layer: A0 | A1 | BOOT0 | 3.3V | +5V | GND | CLK | DIO | RX | TX
